# EasyEDA Pro project Ascend_SolePCB.eprj

# Schematic Schematic1
Board Name: Board1; Create Date: 2024-11-16; Page Name: P1; Project Name: Ascend_SolePCB; Schematic Name: Schematic1; Update Date: 2024-11-16; Company: EasyEDA.com; Drawn: EasyEDA; Page Size: A4; Part Number: JLCPCB-002; Reviewed: EasyEDA; Version: V0.1
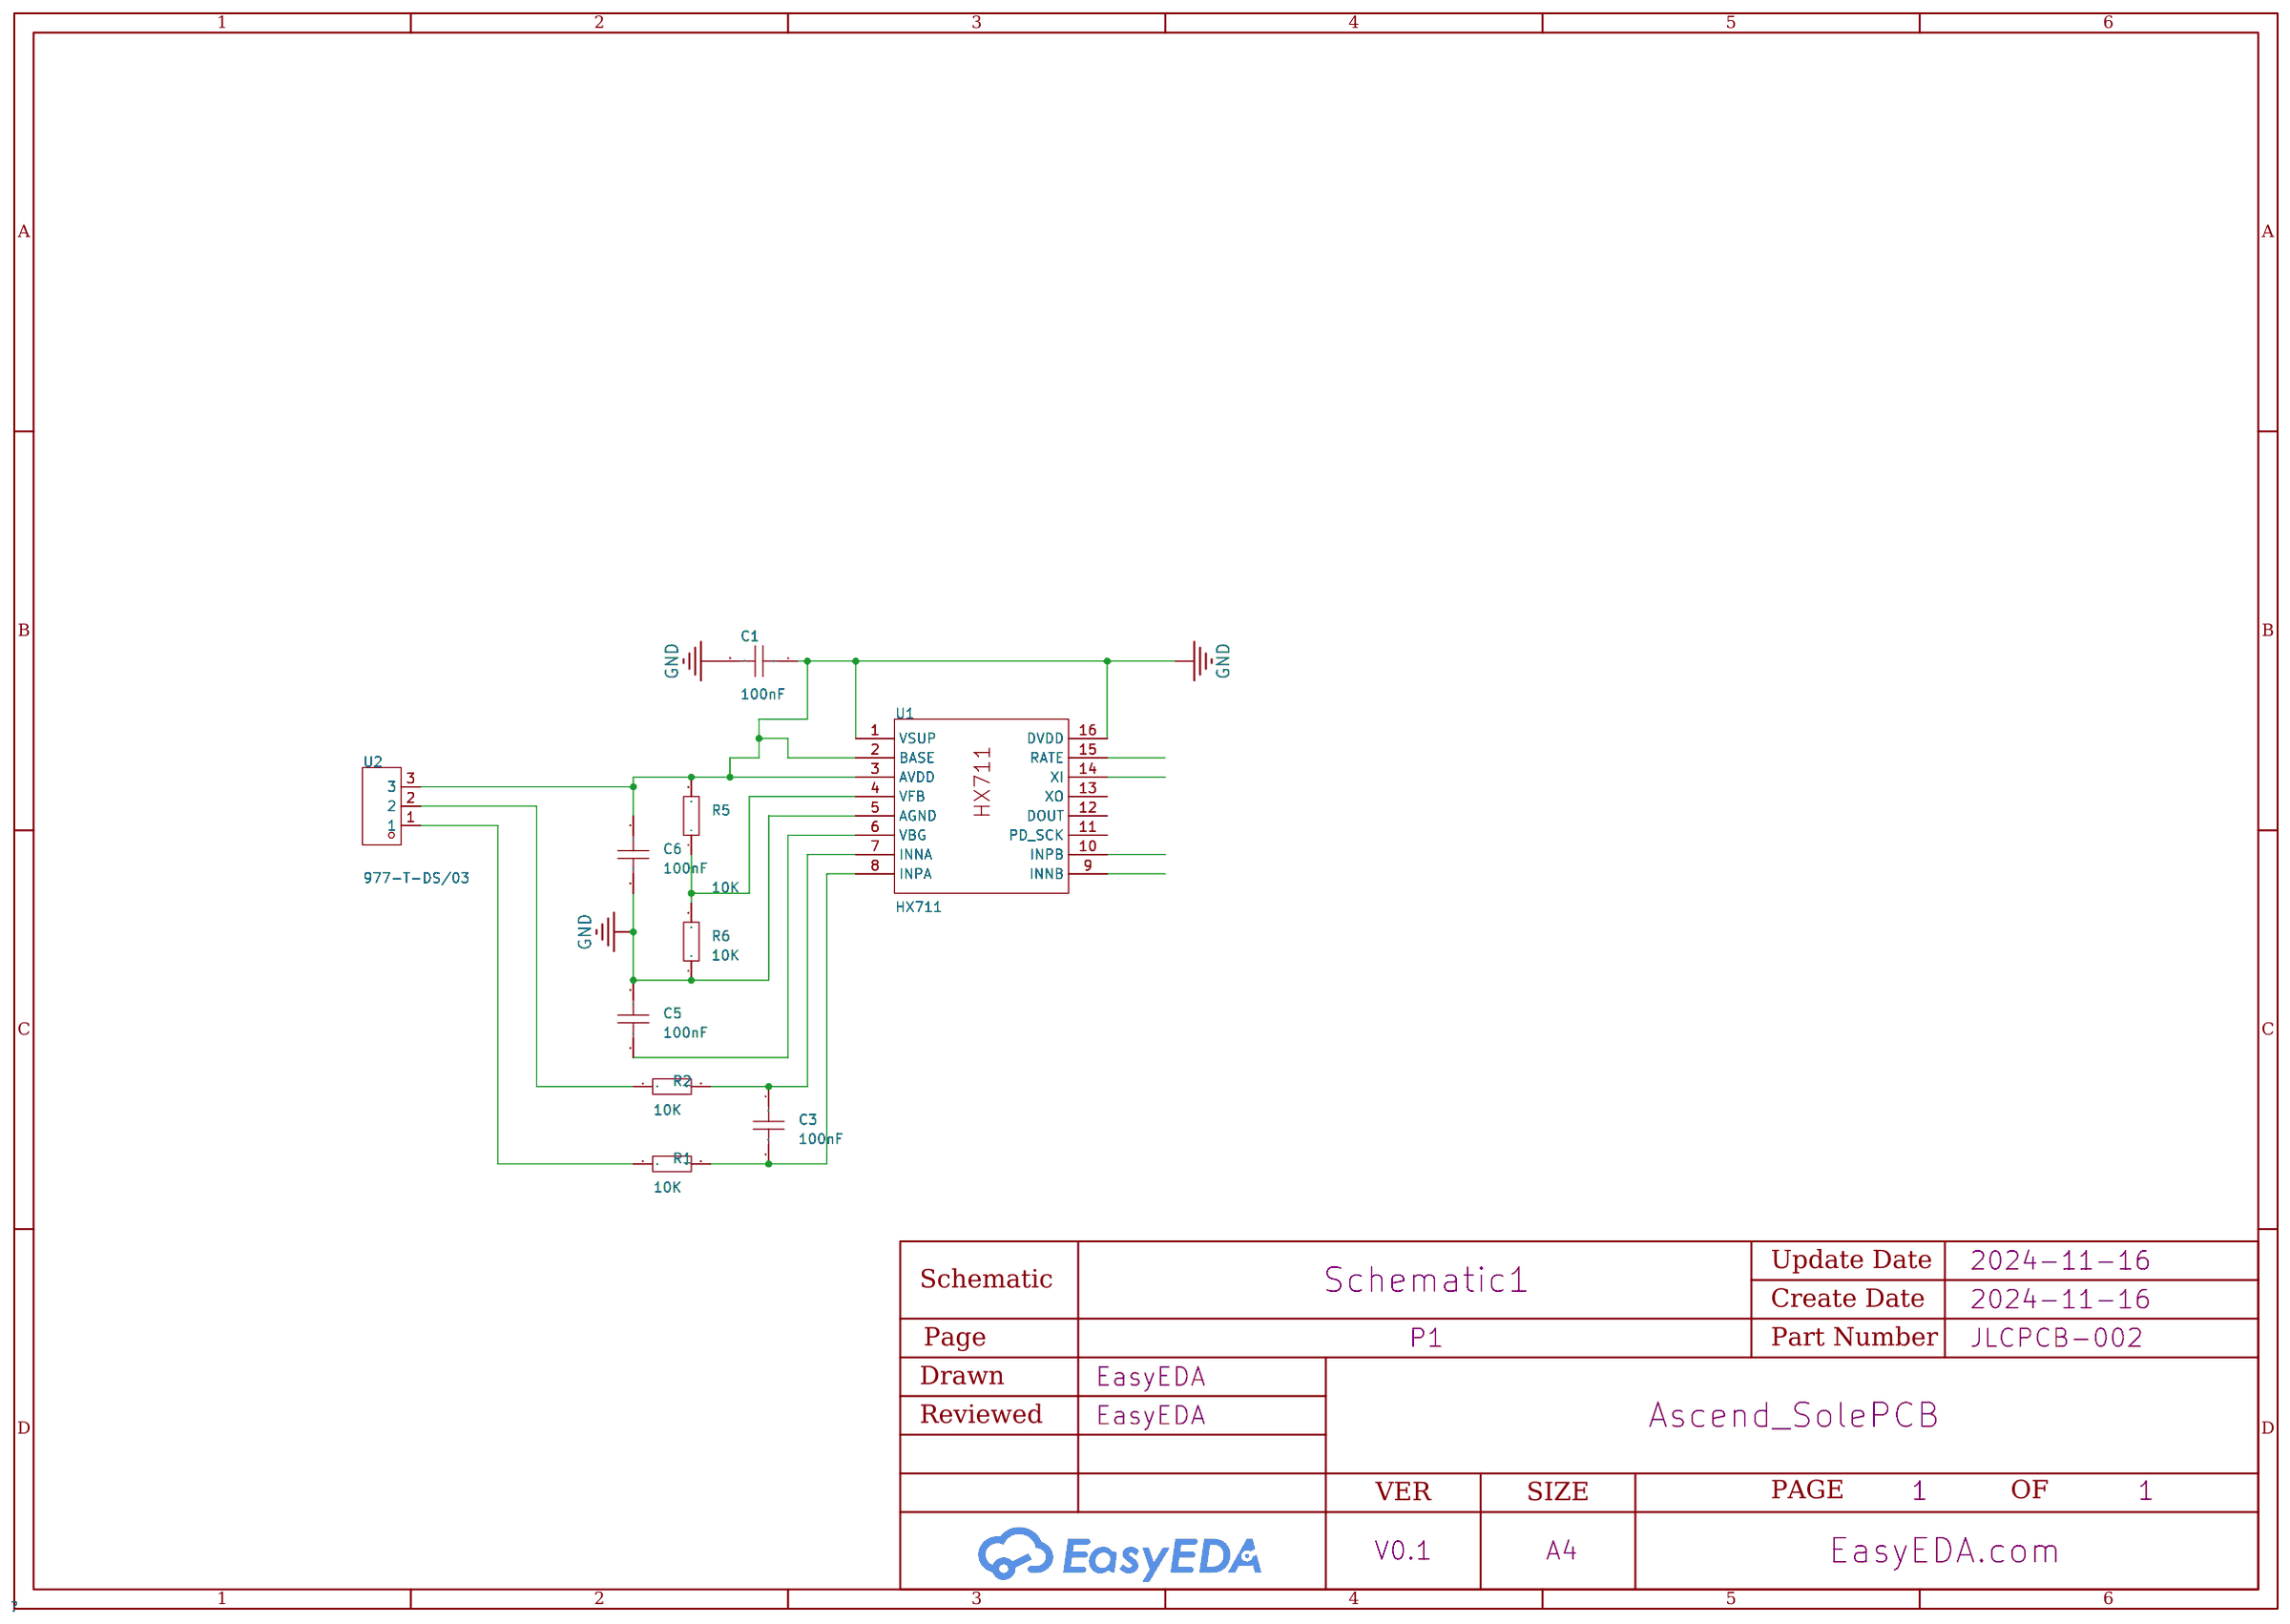
[diagram p0: schematic sheet]

## Parts
C1  100nF  [C0201]
C3  100nF  [C0201]
C5  100nF  [C0201]
C6  100nF  [C0201]
R1  10K  [R0603]
R2  10K  [R0603]
R5  10K  [R0603]
R6  10K  [R0603]
U1  HX711  [SOP-16_L10.0-W3.9-P1.27-LS6.0-BL]
U2  977-T-DS/03  [CONN-TH_3P-P7.50_977-T-DS-03]

## Library data of the parts
C1 C3 C5 C6 = CAP_0201: Supplier Footprint: 0201
R1 R2 R5 R6 = Res_0603: Supplier Footprint: 0603
U1 = HX711: Supplier Part: C43656; Manufacturer: AVIA(海芯科技); Supplier Footprint: SOP-16; JLCPCB Part Class: Extended Part; Datasheet: https://atta.szlcsc.com/upload/public/pdf/source/20201105/C43656_14FD91CAE53E7DB415D03EABCB162D83.pdf; Supplier: LCSC
U2 = 977-T-DS/03: LCSC Part Name: 1x3P 7.5mm 直插 排数:1 每排P数:3; Supplier Part: C19108934; Manufacturer: WECO(威克德诺); Supplier Footprint: 插件,P=7.5mm; JLCPCB Part Class: Extended Part; Datasheet: https://atta.szlcsc.com/upload/public/pdf/source/20231027/2DE82EF6BDFEBE58F3FAD31F2AA22BDE.pdf; Supplier: LCSC; Structure: 1x3P; Pitch: 7.5mm; Color: Gray; Mounting Style: Direct Insert; Current Rating (Max): 24A; Number of Pins: 3P; Number of Rows: 1; Wire Gauge - AWG: 12~18；12~16; Wire Gauge - mm2: 0.75~4；1~6; Number of PINs Per Row: 3; Contact Material: Brass; Contact Plating: Tin; Operating Temperature Range: -40℃~+100℃; Screw Specification: M3

## Nets
GND: C1.1 C1.2 C5.1 C6.1 C6.2 R5.2 R6.1 U1.1(VSUP) U1.2(BASE) U1.3(AVDD) U1.5(AGND) U1.16(DVDD) U2.3
$1N1531: C3.2 R1.2 U1.8(INPA)
$1N1605: C3.1 R2.2 U1.7(INNA)
$1N1611: C5.2 U1.6(VBG)
$1N2179: R5.1 R6.2 U1.4(VFB)
$1N2348: R1.1 U2.1
$1N2354: R2.1 U2.2

Not connected (* = marked no-connect by the designer): U1 9(INNB) 10(INPB) 11(PD_SCK) 12(DOUT) 13(XO) 14(XI) 15(RATE)

# Board PCB1
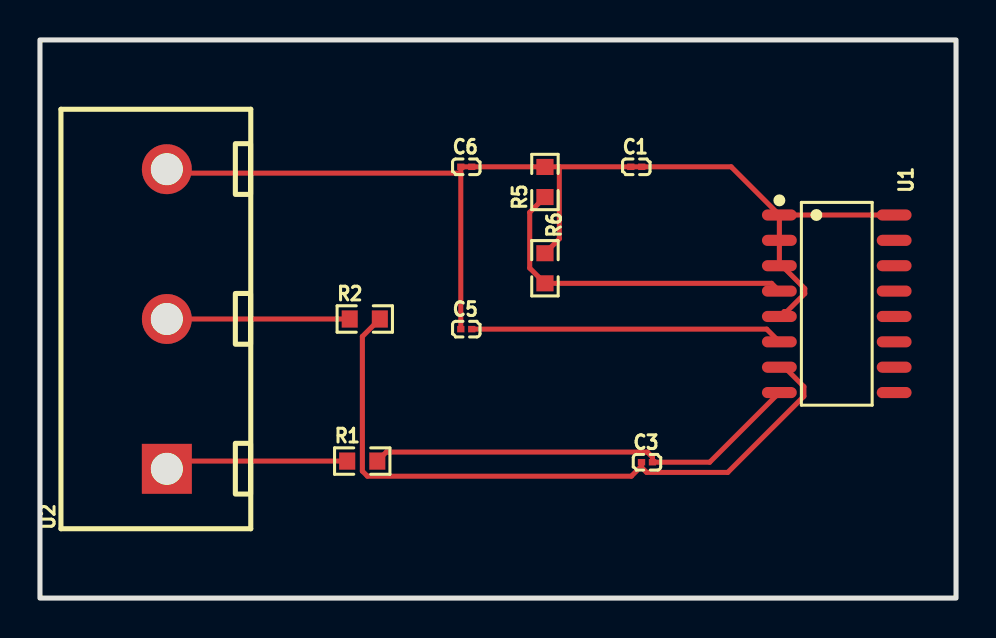
[diagram p1: board, top side]
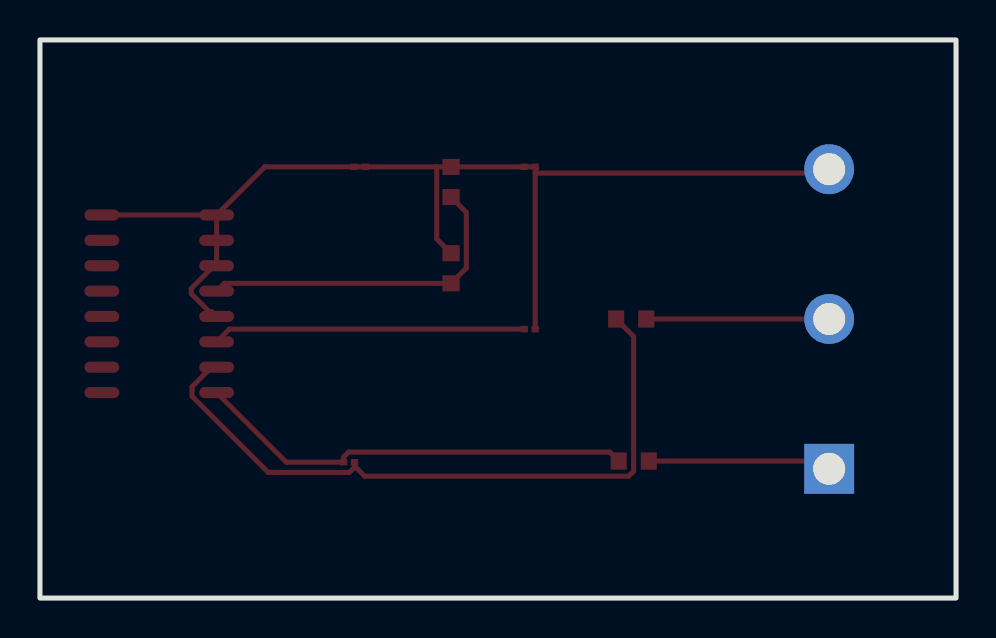
[diagram p2: board, bottom side, seen from below]

Outline 45.85 x 27.94 mm; copper layers: Top Layer, Bottom Layer. Coordinates in mm from the lower left corner of the outline.
Outline path: rectangle 0,27.94 45.85,0
Stack: Top Layer 0.035mm / Dielectric1 1.51mm FR4 er 4.5 / Bottom Layer 0.035mm

## Design rules (mm)
template: JLCPCB Capability(Two Layers Board)
spacing copperThickness1oz (default): track to track 0.102, other pairs 0.152 to 0.3
spacing copperThickness2oz: track to track 0.203, other pairs 0.152 to 0.3
track width copperThickness1oz (default): min 0.127, default 0.254, max 2.54
track width copperThickness2oz: min 0.203, default 0.254, max 2.54
differential pair differentialPair (default): width min 0.127, default 0.254, max 2.54; gap min 0.152, default 0.152
via viaSize (default): diameter min 0.5, default 0.61, max 10; hole min 0.3, default 0.305, max 6.3

## Placement (name value [footprint] x y rotation side)
C1  100nF  [C0201]  29.84 21.59 0 top
C3  100nF  [C0201]  30.38 6.8 0 top
C5  100nF  [C0201]  21.34 13.46 0 top
C6  100nF  [C0201]  21.34 21.59 0 top
R1  10K  [R0603]  16.13 6.86 0 top
R2  10K  [R0603]  16.26 13.97 0 top
R5  10K  [R0603]  25.27 20.83 90 top
R6  10K  [R0603]  25.27 16.51 270 top
U1  HX711  [SOP-16_L10.0-W3.9-P1.27-LS6.0-BL]  39.88 14.73 270 top
U2  977-T-DS/03  [CONN-TH_3P-P7.50_977-T-DS-03]  6.35 13.97 90 top

## Footprints (pads in the part's own frame, mm; a bottom-side part is the same pattern mirrored in y, then rotated)
C0201
  rect 0.368x0.324 smd: 1(-0.275,0) 2(0.275,0)
CONN-TH_3P-P7.50_977-T-DS-03
  rect 2.5x2.5 hole 1.6: 1(-7.5,0)
  round 2.5 hole 1.6: 2(0,0) 3(7.5,0)
R0603
  rect 0.806x0.864 smd: 1(-0.753,0) 2(0.753,0)
SOP-16_L10.0-W3.9-P1.27-LS6.0-BL
  oval 0.56x1.745 smd: 1(-4.445,-2.873) 2(-3.175,-2.873) 3(-1.905,-2.873) 4(-0.635,-2.873) 5(0.635,-2.873) 6(1.905,-2.873) 7(3.175,-2.873) 8(4.445,-2.873) 9(4.445,2.873) 10(3.175,2.873) 11(1.905,2.873) 12(0.635,2.873) 13(-0.635,2.873) 14(-1.905,2.873) 15(-3.175,2.873) 16(-4.445,2.873)

## Nets
As in the schematic.

Pads without a net: U1 11 12 13

## Routing (per net, layer and track width the routed paths; a pad name or vN(x,y) marks a point on that pad's centre or on a via; arc(x,y) is an arc through that point)
GND: length 56.6
  Top Layer w0.254: 37.01,14.1 37.25,14.34 37.38,14.34 38.28,15.24 38.28,15.49 37.01,16.76 ; U1.1 34.59,21.59 C1.2 C1.1 25.99,21.59 ; U1.1 U1.16 ; U1.1 U1.2 37.01,16.76 ; 25.28,21.59 R5.2 ; 25.28,21.59 C6.2 C6.1 21.06,21.27 ; 25.28,21.59 25.99,21.59 ; 21.06,21.27 6.55,21.27 U2.3 ; 21.06,21.27 C5.1 ; 37.01,16.76 U1.3 ; 25.99,21.59 25.99,17.98 R6.1
$1N1531: length 22.1
  Top Layer w0.254: R1.2 17.33,7.31 30.4,7.31 30.65,7.05 C3.2 33.52,6.8 U1.8
$1N1605: length 34.4
  Top Layer w0.254: U1.7 37.08,11.48 37.33,11.48 38.23,10.58 38.23,10.1 34.42,6.29 30.36,6.29 30.11,6.55 30.11,6.61 ; 30.11,6.61 29.6,6.1 16.39,6.1 16.14,6.36 16.14,13.1 R2.2 ; 30.11,6.61 C3.1
$1N1611: length 15.7
  Top Layer w0.254: C5.2 36.37,13.46 U1.6
$1N2179: length 16.8
  Top Layer w0.254: U1.4 36.62,15.76 R6.2 24.51,16.52 24.51,19.31 R5.1
$1N2348: length 9.2
  Top Layer w0.254: R1.1 6.74,6.86 U2.1
$1N2354: length 9.2
  Top Layer w0.254: R2.1 U2.2
